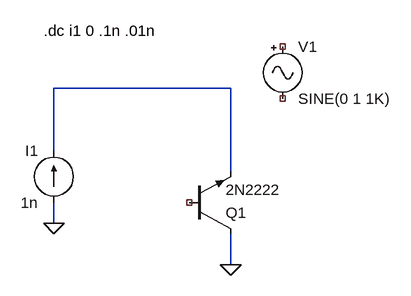
[diagram p0: schematic negistor.asc]
negistor.asc, the LTspice schematic file:
Version 4
SHEET 1 1588 1236
WIRE 592 48 320 48
WIRE 320 144 320 48
WIRE 592 176 592 48
WIRE 320 256 320 224
WIRE 592 320 592 272
FLAG 592 320 0
FLAG 320 256 0
SYMBOL npn 528 272 M180
SYMATTR InstName Q1
SYMATTR Value 2N2222
SYMBOL current 320 224 R180
WINDOW 0 24 80 Left 2
WINDOW 3 24 0 Left 2
WINDOW 123 0 0 Left 0
WINDOW 39 0 0 Left 0
SYMATTR InstName I1
SYMATTR Value 1n
SYMBOL Misc\\signal 672 -32 R0
WINDOW 123 0 0 Left 0
WINDOW 39 0 0 Left 0
SYMATTR InstName V1
TEXT 304 -40 Left 2 !.dc i1 0 .1n .01n

The netlist it stands for:
* negistor.asc
Q1 0 NC_01 N001 0 2N2222
I1 0 N001 1n
V1 NC_02 NC_03 SINE(0 1 1K)
.model NPN NPN
.model PNP PNP
.lib standard.bjt
.dc i1 0 .1n .01n
.backanno
.end